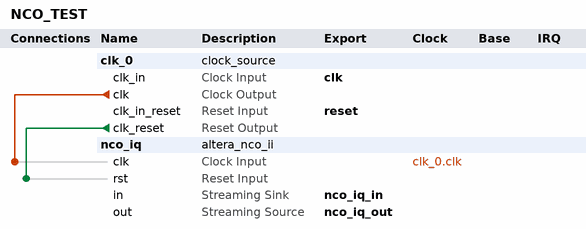
[diagram p0: system contents]
# Platform Designer (Qsys) system NCO_TEST, Cyclone V 5CEBA4F23C7
# Parameters at their usual value, and those the tool derives, are not listed.
package require -exact qsys 17.0
create_system NCO_TEST
set_project_property DEVICE_FAMILY {Cyclone V}
set_project_property DEVICE 5CEBA4F23C7

add_instance clk_0 clock_source 17.0
set_instance_parameter_value clk_0 clockFrequency 50000000

add_instance nco_iq altera_nco_ii 17.0
set_instance_parameter_value nco_iq apr 13
set_instance_parameter_value nco_iq apri 10
set_instance_parameter_value nco_iq arch large_rom
set_instance_parameter_value nco_iq freq_out 0.005
set_instance_parameter_value nco_iq fsamp 0.1
set_instance_parameter_value nco_iq mpr 10
set_instance_parameter_value nco_iq selected_device_family {Cyclone V}
set_instance_parameter_value nco_iq want_sin_and_cos single_output

# connections
add_connection clk_0.clk nco_iq.clk clock
add_connection clk_0.clk_reset nco_iq.rst reset

# exported interfaces
add_interface clk clock sink
set_interface_property clk EXPORT_OF clk_0.clk_in
add_interface nco_iq_in avalon_streaming sink
set_interface_property nco_iq_in EXPORT_OF nco_iq.in
add_interface nco_iq_out avalon_streaming source
set_interface_property nco_iq_out EXPORT_OF nco_iq.out
add_interface reset reset sink
set_interface_property reset EXPORT_OF clk_0.clk_in_reset

set_interconnect_requirement {$system} qsys_mm.clockCrossingAdapter HANDSHAKE
set_interconnect_requirement {$system} qsys_mm.enableEccProtection FALSE
set_interconnect_requirement {$system} qsys_mm.insertDefaultSlave FALSE
set_interconnect_requirement {$system} qsys_mm.maxAdditionalLatency 1

save_system NCO_TEST.qsys
